# EAGLE design platform_all1 (EAGLE 6.5.0)
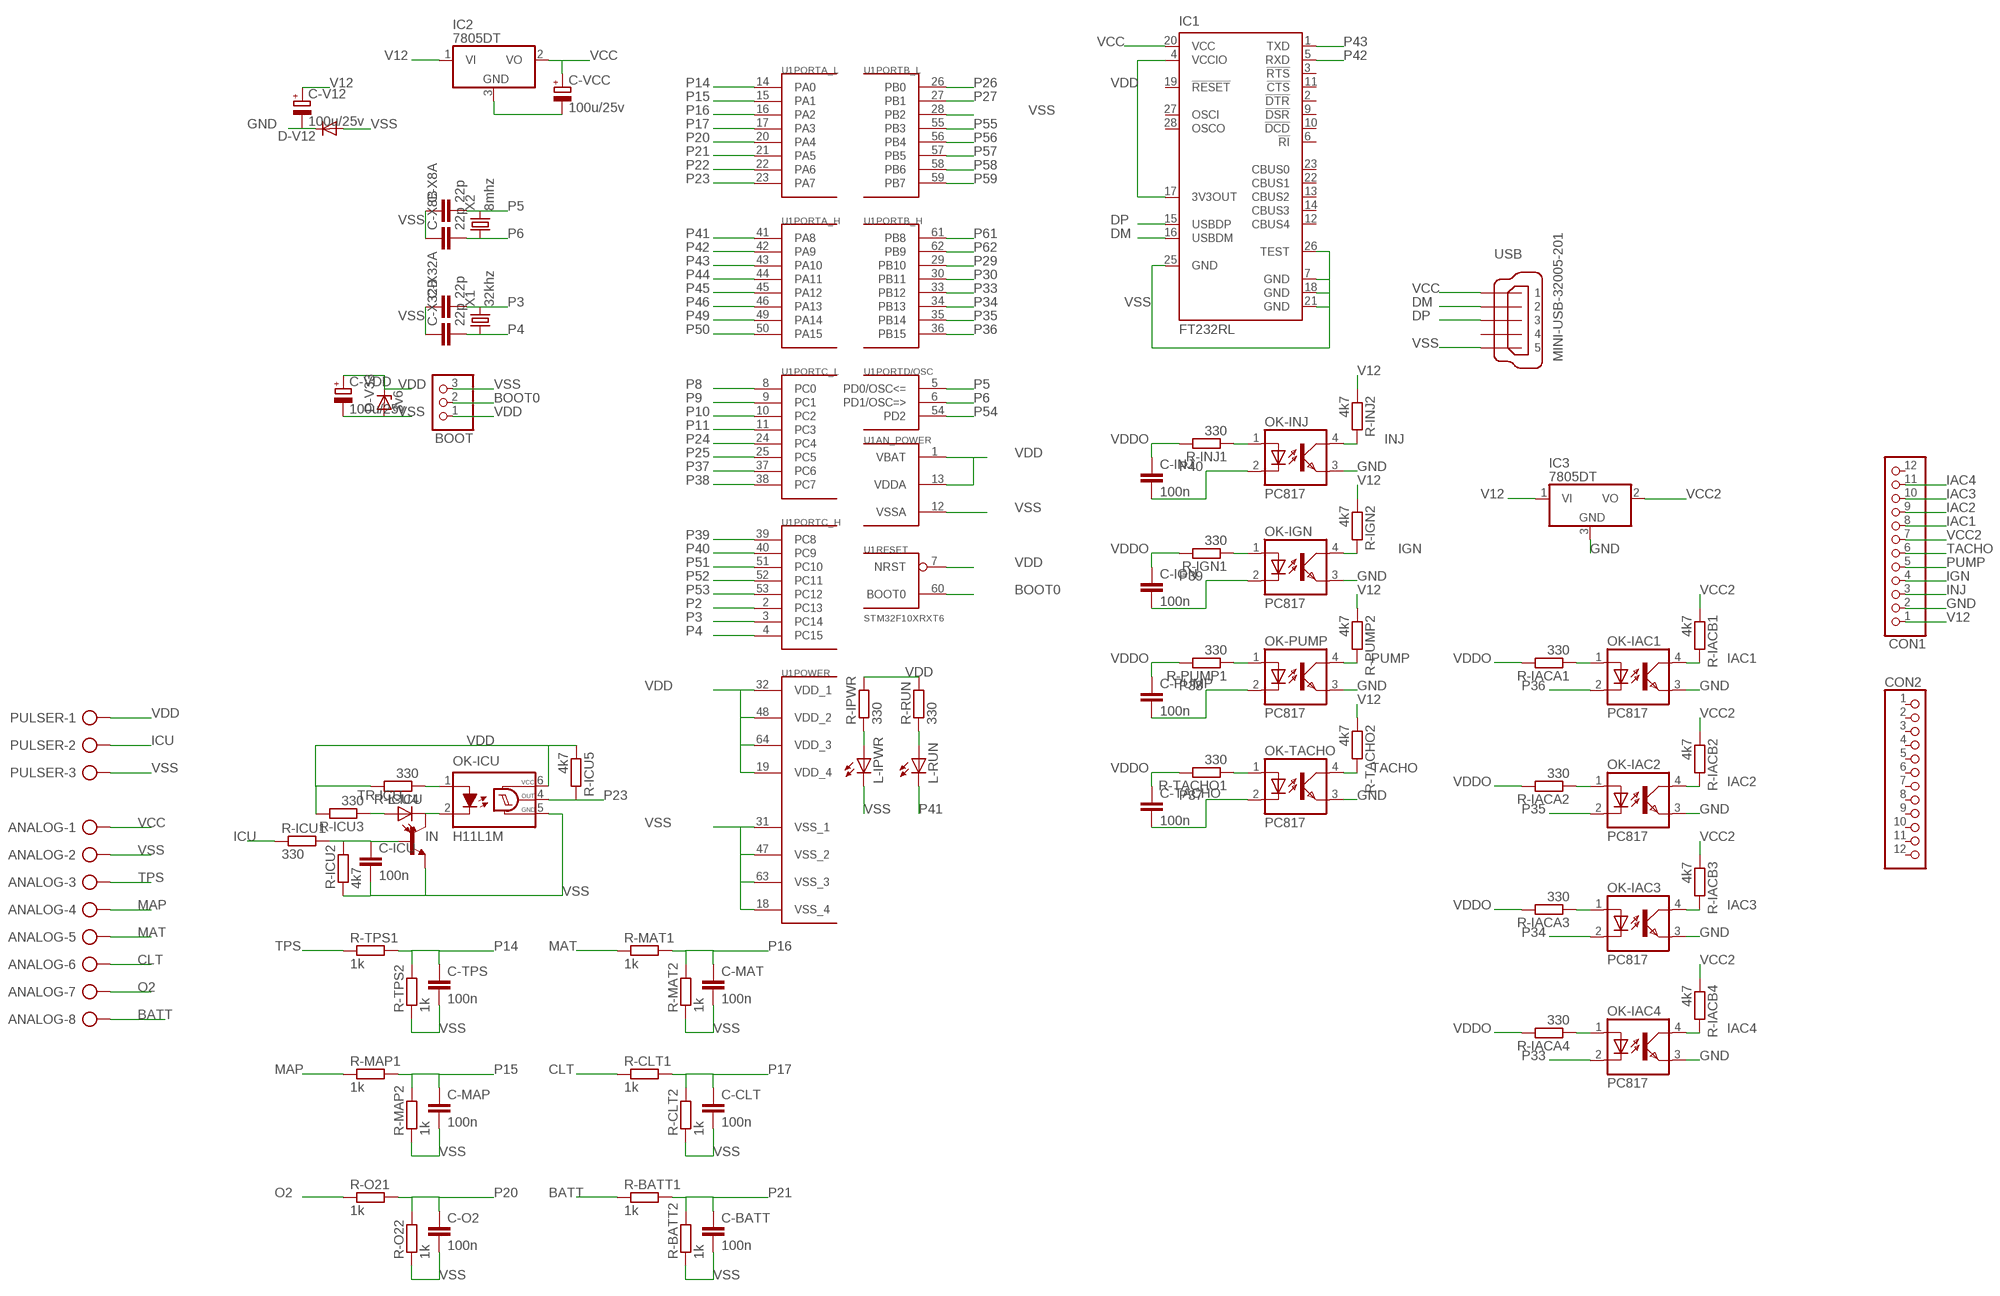
[diagram p0: schematic, sheet 1]

## Parts
ANALOG  AK300/8  [AK300/8]
BOOT  PINHD-1X3  [1X03]
C-BATT  100n  C-EUC1206  [C1206]
C-CLT  100n  C-EUC1206  [C1206]
C-ICU  100n  C-EUC1206  [C1206]
C-IGN  100n  C-EUC1206  [C1206]
C-INJ  100n  C-EUC1206  [C1206]
C-MAP  100n  C-EUC1206  [C1206]
C-MAT  100n  C-EUC1206  [C1206]
C-O2  100n  C-EUC1206  [C1206]
C-PUMP  100n  C-EUC1206  [C1206]
C-TACHO  100n  C-EUC1206  [C1206]
C-TPS  100n  C-EUC1206  [C1206]
C-V12  100u/25v  CPOL-EUD  [PANASONIC_D]
C-VCC  100u/25v  CPOL-EUD  [PANASONIC_D]
C-VDD  100u/25v  CPOL-EUD  [PANASONIC_D]
C-X8A  22p  C-EUC1206  [C1206]
C-X8B  22p  C-EUC1206  [C1206]
C-X32A  22p  C-EUC1206  [C1206]
C-X32B  22p  C-EUC1206  [C1206]
CON1  PINHD-1X12  [1X12]
CON2  PINHD-1X12  [1X12]
D-V12  DIODE-SMB  [SMB]
D-V33  3v6  ZENER-DIODESMB  [SMB]
IC1  FT232RL  [SSOP28]
IC2  7805DT  [TO252]
IC3  7805DT  [TO252]
L-ICU  LEDSMT1206  [1206]
L-IPWR  LEDSMT1206  [1206]
L-RUN  LEDSMT1206  [1206]
OK-IAC1  PC817  [DIL04]
OK-IAC2  PC817  [DIL04]
OK-IAC3  PC817  [DIL04]
OK-IAC4  PC817  [DIL04]
OK-ICU  H11L1M  [DIL06]
OK-IGN  PC817  [DIL04]
OK-INJ  PC817  [DIL04]
OK-PUMP  PC817  [DIL04]
OK-TACHO  PC817  [DIL04]
PULSER  AK300/3  [AK300/3]
R-BATT1  1k  R-EU_R1206  [R1206]
R-BATT2  1k  R-EU_R1206  [R1206]
R-CLT1  1k  R-EU_R1206  [R1206]
R-CLT2  1k  R-EU_R1206  [R1206]
R-IACA1  330  R-EU_R1206  [R1206]
R-IACA2  330  R-EU_R1206  [R1206]
R-IACA3  330  R-EU_R1206  [R1206]
R-IACA4  330  R-EU_R1206  [R1206]
R-IACB1  4k7  R-EU_R1206  [R1206]
R-IACB2  4k7  R-EU_R1206  [R1206]
R-IACB3  4k7  R-EU_R1206  [R1206]
R-IACB4  4k7  R-EU_R1206  [R1206]
R-ICU1  330  R-EU_R1206  [R1206]
R-ICU2  4k7  R-EU_R1206  [R1206]
R-ICU3  330  R-EU_R1206  [R1206]
R-ICU4  330  R-EU_R1206  [R1206]
R-ICU5  4k7  R-EU_R1206  [R1206]
R-IGN1  330  R-EU_R1206  [R1206]
R-IGN2  4k7  R-EU_R1206  [R1206]
R-INJ1  330  R-EU_R1206  [R1206]
R-INJ2  4k7  R-EU_R1206  [R1206]
R-IPWR  330  R-EU_R1206  [R1206]
R-MAP1  1k  R-EU_R1206  [R1206]
R-MAP2  1k  R-EU_R1206  [R1206]
R-MAT1  1k  R-EU_R1206  [R1206]
R-MAT2  1k  R-EU_R1206  [R1206]
R-O21  1k  R-EU_R1206  [R1206]
R-O22  1k  R-EU_R1206  [R1206]
R-PUMP1  330  R-EU_R1206  [R1206]
R-PUMP2  4k7  R-EU_R1206  [R1206]
R-RUN  330  R-EU_R1206  [R1206]
R-TACHO1  330  R-EU_R1206  [R1206]
R-TACHO2  4k7  R-EU_R1206  [R1206]
R-TPS1  1k  R-EU_R1206  [R1206]
R-TPS2  1k  R-EU_R1206  [R1206]
TR-ICU  MMBT3904LT1-NPN-SOT23-BEC  [SOT23-BEC]
U1  STM32F10XRXT6  [TQFP64]
USB  MINI-USB-32005-201  [32005-201]
X1  32khz  CRYSTALTC26V  [TC26V]
X2  8mhz  CRYSTALHC49U-V  [HC49U-V]

## Nets
BATT: ANALOG.8 R-BATT1.1
BOOT0: BOOT.2 U1.60(RESET:BOOT0)
CLT: ANALOG.6 R-CLT1.1
DM: IC1.16(USBDM) USB.2
DP: IC1.15(USBDP) USB.3
GND: C-V12.- CON1.2 D-V12.C IC3.3(GND) OK-IAC1.3(EMIT) OK-IAC2.3(EMIT) OK-IAC3.3(EMIT) OK-IAC4.3(EMIT) OK-IGN.3(EMIT) OK-INJ.3(EMIT) OK-PUMP.3(EMIT) OK-TACHO.3(EMIT)
IAC1: CON1.8 OK-IAC1.4(COL) R-IACB1.2
IAC2: CON1.9 OK-IAC2.4(COL) R-IACB2.2
IAC3: CON1.10 OK-IAC3.4(COL) R-IACB3.2
IAC4: CON1.11 OK-IAC4.4(COL) R-IACB4.2
ICU: PULSER.2 R-ICU1.1
IGN: CON1.4 OK-IGN.4(COL) R-IGN2.2
IN: L-ICU.C OK-ICU.2(C) TR-ICU.C
INJ: CON1.3 OK-INJ.4(COL) R-INJ2.2
MAP: ANALOG.4 R-MAP1.1
MAT: ANALOG.5 R-MAT1.1
N$1: OK-TACHO.1(A) R-TACHO1.1
N$2: OK-IAC2.1(A) R-IACA2.1
N$3: C-ICU.1 R-ICU1.2 R-ICU2.2 TR-ICU.B
N$4: OK-IAC1.1(A) R-IACA1.1
N$5: OK-ICU.1(A) R-ICU4.1
N$6: L-ICU.A R-ICU3.1
N$7: L-IPWR.A R-IPWR.1
N$8: L-RUN.A R-RUN.1
N$9: OK-PUMP.1(A) R-PUMP1.1
N$10: OK-IAC3.1(A) R-IACA3.1
N$11: OK-IAC4.1(A) R-IACA4.1
N$13: OK-INJ.1(A) R-INJ1.1
N$15: OK-IGN.1(A) R-IGN1.1
O2: ANALOG.7 R-O21.1
P2: U1.2(PORTC_H:PC13)
P3: C-X32A.2 U1.3(PORTC_H:PC14) X1.2
P4: C-X32B.2 U1.4(PORTC_H:PC15) X1.1
P5: C-X8A.2 U1.5(PORTD/OSC:PD0/OSC<=) X2.2
P6: C-X8B.2 U1.6(PORTD/OSC:PD1/OSC=>) X2.1
P8: U1.8(PORTC_L:PC0)
P9: U1.9(PORTC_L:PC1)
P10: U1.10(PORTC_L:PC2)
P11: U1.11(PORTC_L:PC3)
P14: C-TPS.1 R-TPS1.2 R-TPS2.2 U1.14(PORTA_L:PA0)
P15: C-MAP.1 R-MAP1.2 R-MAP2.2 U1.15(PORTA_L:PA1)
P16: C-MAT.1 R-MAT1.2 R-MAT2.2 U1.16(PORTA_L:PA2)
P17: C-CLT.1 R-CLT1.2 R-CLT2.2 U1.17(PORTA_L:PA3)
P20: C-O2.1 R-O21.2 R-O22.2 U1.20(PORTA_L:PA4)
P21: C-BATT.1 R-BATT1.2 R-BATT2.2 U1.21(PORTA_L:PA5)
P22: U1.22(PORTA_L:PA6)
P23: OK-ICU.4(OUT) R-ICU5.2 U1.23(PORTA_L:PA7)
P24: U1.24(PORTC_L:PC4)
P25: U1.25(PORTC_L:PC5)
P26: U1.26(PORTB_L:PB0)
P27: U1.27(PORTB_L:PB1)
P29: U1.29(PORTB_H:PB10)
P30: U1.30(PORTB_H:PB11)
P33: OK-IAC4.2(C) U1.33(PORTB_H:PB12)
P34: OK-IAC3.2(C) U1.34(PORTB_H:PB13)
P35: OK-IAC2.2(C) U1.35(PORTB_H:PB14)
P36: OK-IAC1.2(C) U1.36(PORTB_H:PB15)
P37: C-TACHO.2 OK-TACHO.2(C) U1.37(PORTC_L:PC6)
P38: C-PUMP.2 OK-PUMP.2(C) U1.38(PORTC_L:PC7)
P39: C-IGN.2 OK-IGN.2(C) U1.39(PORTC_H:PC8)
P40: C-INJ.2 OK-INJ.2(C) U1.40(PORTC_H:PC9)
P41: L-RUN.C U1.41(PORTA_H:PA8)
P42: IC1.5(RXD) U1.42(PORTA_H:PA9)
P43: IC1.1(TXD) U1.43(PORTA_H:PA10)
P44: U1.44(PORTA_H:PA11)
P45: U1.45(PORTA_H:PA12)
P46: U1.46(PORTA_H:PA13)
P49: U1.49(PORTA_H:PA14)
P50: U1.50(PORTA_H:PA15)
P51: U1.51(PORTC_H:PC10)
P52: U1.52(PORTC_H:PC11)
P53: U1.53(PORTC_H:PC12)
P54: U1.54(PORTD/OSC:PD2)
P55: U1.55(PORTB_L:PB3)
P56: U1.56(PORTB_L:PB4)
P57: U1.57(PORTB_L:PB5)
P58: U1.58(PORTB_L:PB6)
P59: U1.59(PORTB_L:PB7)
P61: U1.61(PORTB_H:PB8)
P62: U1.62(PORTB_H:PB9)
PUMP: CON1.5 OK-PUMP.4(COL) R-PUMP2.2
TACHO: CON1.6 OK-TACHO.4(COL) R-TACHO2.2
TPS: ANALOG.3 R-TPS1.1
V12: C-V12.+ CON1.1 IC2.1(VI) IC3.1(VI) R-IGN2.1 R-INJ2.1 R-PUMP2.1 R-TACHO2.1
VCC: ANALOG.1 C-VCC.+ IC1.20(VCC) IC2.2(VO) USB.1
VCC2: CON1.7 IC3.2(VO) R-IACB1.1 R-IACB2.1 R-IACB3.1 R-IACB4.1
VDD: BOOT.1 C-VDD.+ D-V33.C IC1.4(VCCIO) IC1.17(3V3OUT) OK-ICU.6(VCC) PULSER.1 R-ICU3.2 R-ICU4.2 R-ICU5.1 R-IPWR.2 R-RUN.2 U1.1(AN_POWER:VBAT) U1.7(RESET:NRST) U1.13(AN_POWER:VDDA) U1.19(POWER:VDD_4) U1.32(POWER:VDD_1) U1.48(POWER:VDD_2) U1.64(POWER:VDD_3)
VDDO: C-IGN.1 C-INJ.1 C-PUMP.1 C-TACHO.1 R-IACA1.2 R-IACA2.2 R-IACA3.2 R-IACA4.2 R-IGN1.2 R-INJ1.2 R-PUMP1.2 R-TACHO1.2
VSS: ANALOG.2 BOOT.3 C-BATT.2 C-CLT.2 C-ICU.2 C-MAP.2 C-MAT.2 C-O2.2 C-TPS.2 C-VCC.- C-VDD.- C-X8A.1 C-X8B.1 C-X32A.1 C-X32B.1 D-V12.A D-V33.A IC1.7(GND) IC1.18(GND) IC1.21(GND) IC1.25(GND) IC1.26(TEST) IC2.3(GND) L-IPWR.C OK-ICU.5(GND) PULSER.3 R-BATT2.1 R-CLT2.1 R-ICU2.1 R-MAP2.1 R-MAT2.1 R-O22.1 R-TPS2.1 TR-ICU.E U1.12(AN_POWER:VSSA) U1.18(POWER:VSS_4) U1.28(PORTB_L:PB2) U1.31(POWER:VSS_1) U1.47(POWER:VSS_2) U1.63(POWER:VSS_3) USB.5
Unconnected: CON1.12 CON2.1 CON2.2 CON2.3 CON2.4 CON2.5 CON2.6 CON2.7 CON2.8 CON2.9 CON2.10 CON2.11 CON2.12 IC1.2(!DTR) IC1.3(!RTS) IC1.6(!RI) IC1.9(!DSR) IC1.10(!DCD) IC1.11(!CTS) IC1.12(CBUS4) IC1.13(CBUS2) IC1.14(CBUS3) IC1.19(!RESET) IC1.22(CBUS1) IC1.23(CBUS0) IC1.27(OSCI) IC1.28(OSCO) USB.4

## Library data of the parts
ANALOG = con-ptr500:AK300/8: CONNECTOR; OC_FARNELL: unknown; OC_NEWARK: unknown
BOOT = pinhead:PINHD-1X3: PIN HEADER
C-BATT C-CLT C-ICU C-IGN C-INJ C-MAP C-MAT C-O2 C-PUMP C-TACHO C-TPS C-X8A C-X8B C-X32A C-X32B = resistor:C-EU: CAPACITOR, European symbol
C-V12 C-VCC C-VDD = resistor:CPOL-EU: POLARIZED CAPACITOR, European symbol
CON1 CON2 = pinhead:PINHD-1X12: PIN HEADER
D-V12 = diode:DIODE-: DIODE
D-V33 = diode:ZENER-DIODE: Z-Diode
IC1 = ftdichip:FT232R: Source: http://www.ftdichip.com/Documents/DataSheets/DS_FT232R_v104.pdf; MPN: FT232RL; OC_FARNELL: 1146032; OC_NEWARK: 91K9918
IC2 IC3 = linear:78*: Positive VOLTAGE REGULATOR Source: http://cache.national.com/ds/LM/LM78L05.pdf http://www.fairchildsemi.com/ds/LM/LM7805.pdf
L-ICU L-IPWR L-RUN = led:LED: LED OSRAM: - CHIPLED LG R971, LG N971, LY N971, LG Q971, LY Q971, LO R971, LY R971 LH N974, LH R974 LS Q976, LO Q976, LY Q976 LO Q996 - Hyper CHIPLED LW Q18S LB Q993, LB Q99A, LB R99A - SideLED LS A670, LO A670, LY A670, LG A670, LP A670 LB A673, LV A673, LT A673, LW A673 LH A674 LY A675 LS A676, LA A676, LO A676, LY A676, LW A676 LS A679, LY A679, LG A679 - Hyper Micro SIDELED® LS Y876, LA Y876, LO Y876, LY Y876 LT Y87S - SmartLED LW L88C, LW L88S LB L89C, LB L89S, LG L890 LS L89K, LO L89K, LY L89K LS L896, LA L896, LO L896, LY L896 - TOPLED LS T670, LO T670, LY T670, LG T670, LP T670 LSG T670, LSP T670, LSY T670, LOP T670, LYG T670 LG T671, LOG T671, LSG T671 LB T673, LV T673, LT T673, LW T673 LH T674 LS T676, LA T676, LO T676, LY T676, LB T676, LH T676, LSB T676, LW T676 LB T67C, LV T67C, LT T67C, LS T67K, LO T67K, LY T67K, LW E67C LS E67B, LA E67B, LO E67B, LY E67B, LB E67C, LV E67C, LT E67C LW T67C LS T679, LY T679, LG T679 LS T770, LO T770, LY T770, LG T770, LP T770 LB T773, LV T773, LT T773, LW T773 LH T774 LS E675, LA E675, LY E675, LS T675 LS T776, LA T776, LO T776, LY T776, LB T776 LHGB T686 LT T68C, LB T68C - Hyper Mini TOPLED® LB M676 - Mini TOPLED Santana® LG M470 LS M47K, LO M47K, LY M47K Source: http://www.osram.convergy.de LUXEON: - LUMILED® LXK2-PW12-R00, LXK2-PW12-S00, LXK2-PW14-U00, LXK2-PW14-V00 LXK2-PM12-R00, LXK2-PM12-S00, LXK2-PM14-U00 LXK2-PE12-Q00, LXK2-PE12-R00, LXK2-PE12-S00, LXK2-PE14-T00, LXK2-PE14-U00 LXK2-PB12-K00, LXK2-PB12-L00, LXK2-PB12-M00, LXK2-PB14-N00, LXK2-PB14-P00, LXK2-PB14-Q00 LXK2-PR12-L00, LXK2-PR12-M00, LXK2-PR14-Q00, LXK2-PR14-R00 LXK2-PD12-Q00, LXK2-PD12-R00, LXK2-PD12-S00 LXK2-PH12-R00, LXK2-PH12-S00 LXK2-PL12-P00, LXK2-PL12-Q00, LXK2-PL12-R00 Source: www.luxeon.com KINGBRIGHT: KA-3528ASYC Source: www.kingbright.com
OK-IAC1-OK-IAC4 OK-IGN OK-INJ OK-PUMP OK-TACHO = optocoupler:PC817: SHARP OPTO COUPLER; MPN: PC817X4J000F; OC_FARNELL: 9707727; OC_NEWARK: 97K7059
OK-ICU = optocoupler:H11L*M: 6-Pin DIP Optocoupler Source: http://www.fairchildsemi.com/ds/H1/H11L2-M.pdf; MF: FAIRCHILD SEMICONDUCTOR; MPN: H11L1-M; OC_FARNELL: 1021127; OC_NEWARK: 72K8643
PULSER = con-ptr500:AK300/3: CONNECTOR; OC_FARNELL: unknown; OC_NEWARK: unknown
R-BATT1 R-BATT2 R-CLT1 R-CLT2 R-IACA1-R-IACA4 R-IACB1-R-IACB4 R-ICU1-R-ICU5 R-IGN1 R-IGN2 R-INJ1 R-INJ2 R-IPWR R-MAP1 R-MAP2 R-MAT1 R-MAT2 R-O21 R-O22 R-PUMP1 R-PUMP2 R-RUN R-TACHO1 R-TACHO2 R-TPS1 R-TPS2 = resistor:R-EU_: RESISTOR, European symbol
TR-ICU = transistor:*-NPN-: NPN Transistror BF959 corrected 2008.03.06
U1 = stm32:STM32F10XRXT6: STM32F101/103 64pin LQFP
USB = con-cypressindustries:MINI-USB-: MINI USB-B Conector Source: www.cypressindustries.com; OC_FARNELL: unknown; OC_NEWARK: unknown
X1 = crystal:CRYSTAL: CRYSTAL; OC_FARNELL: unknown; OC_NEWARK: unknown
X2 = crystal:CRYSTAL: CRYSTAL; OC_FARNELL: 1666969; OC_NEWARK: unknown

## Board
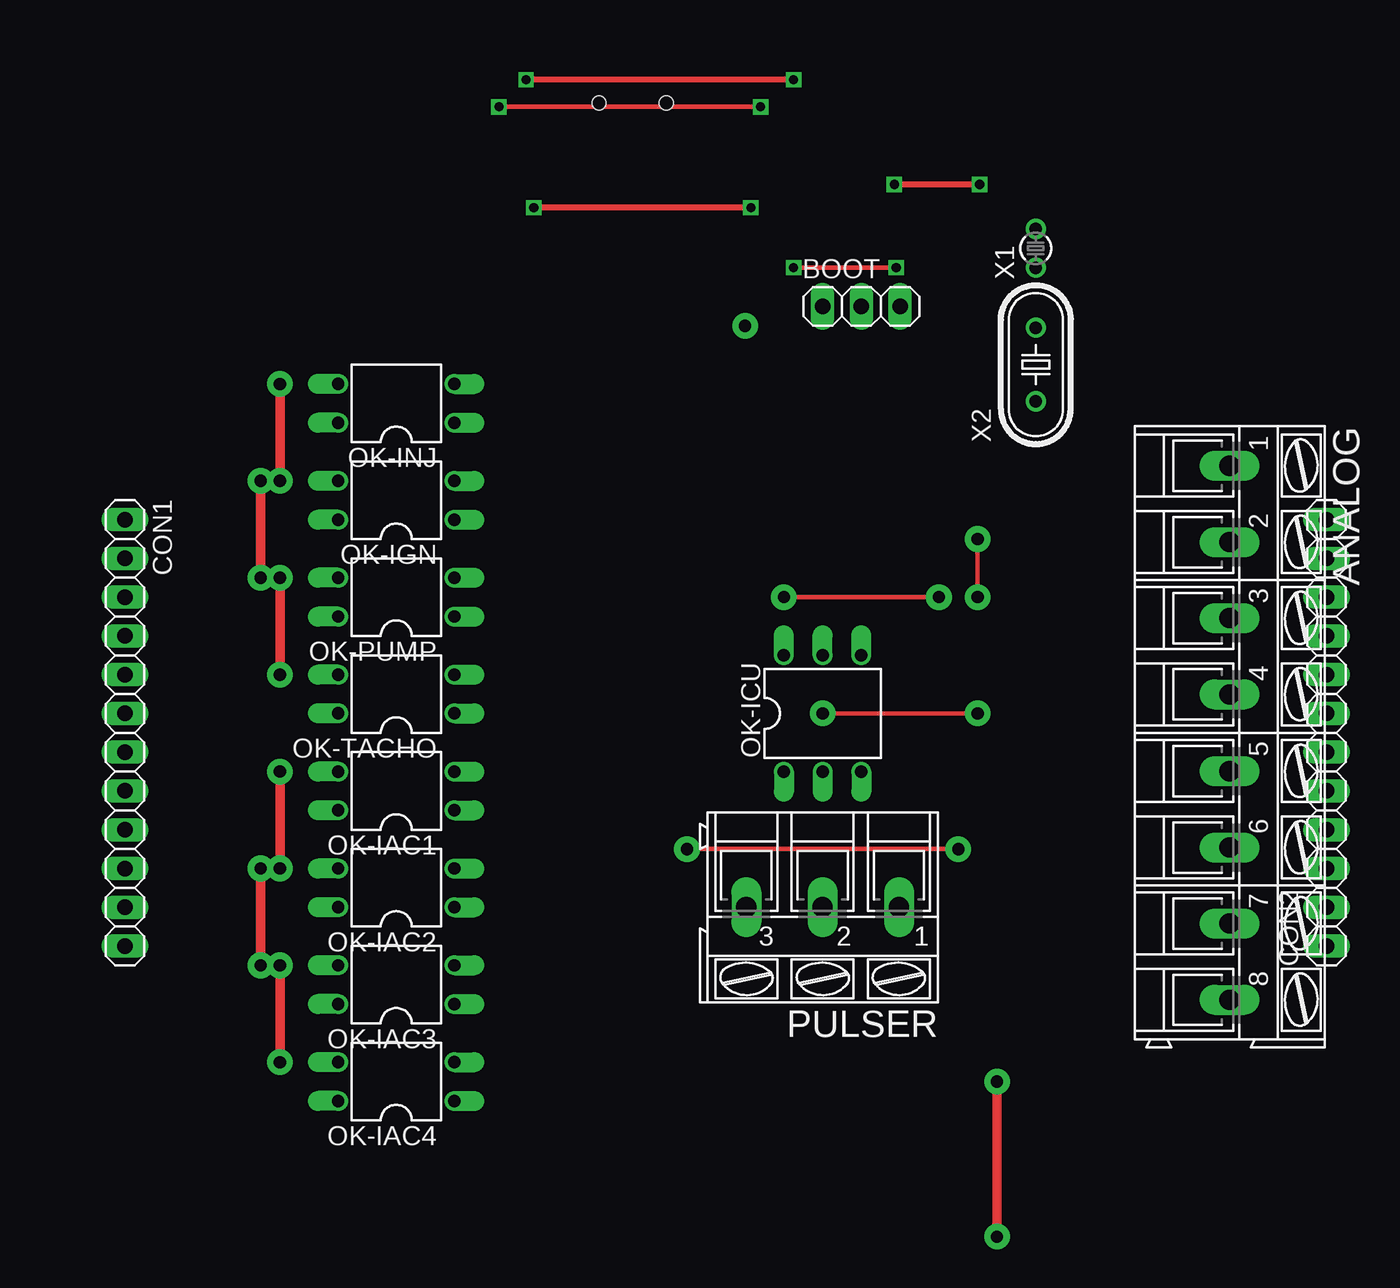
[diagram p1: board, top side]
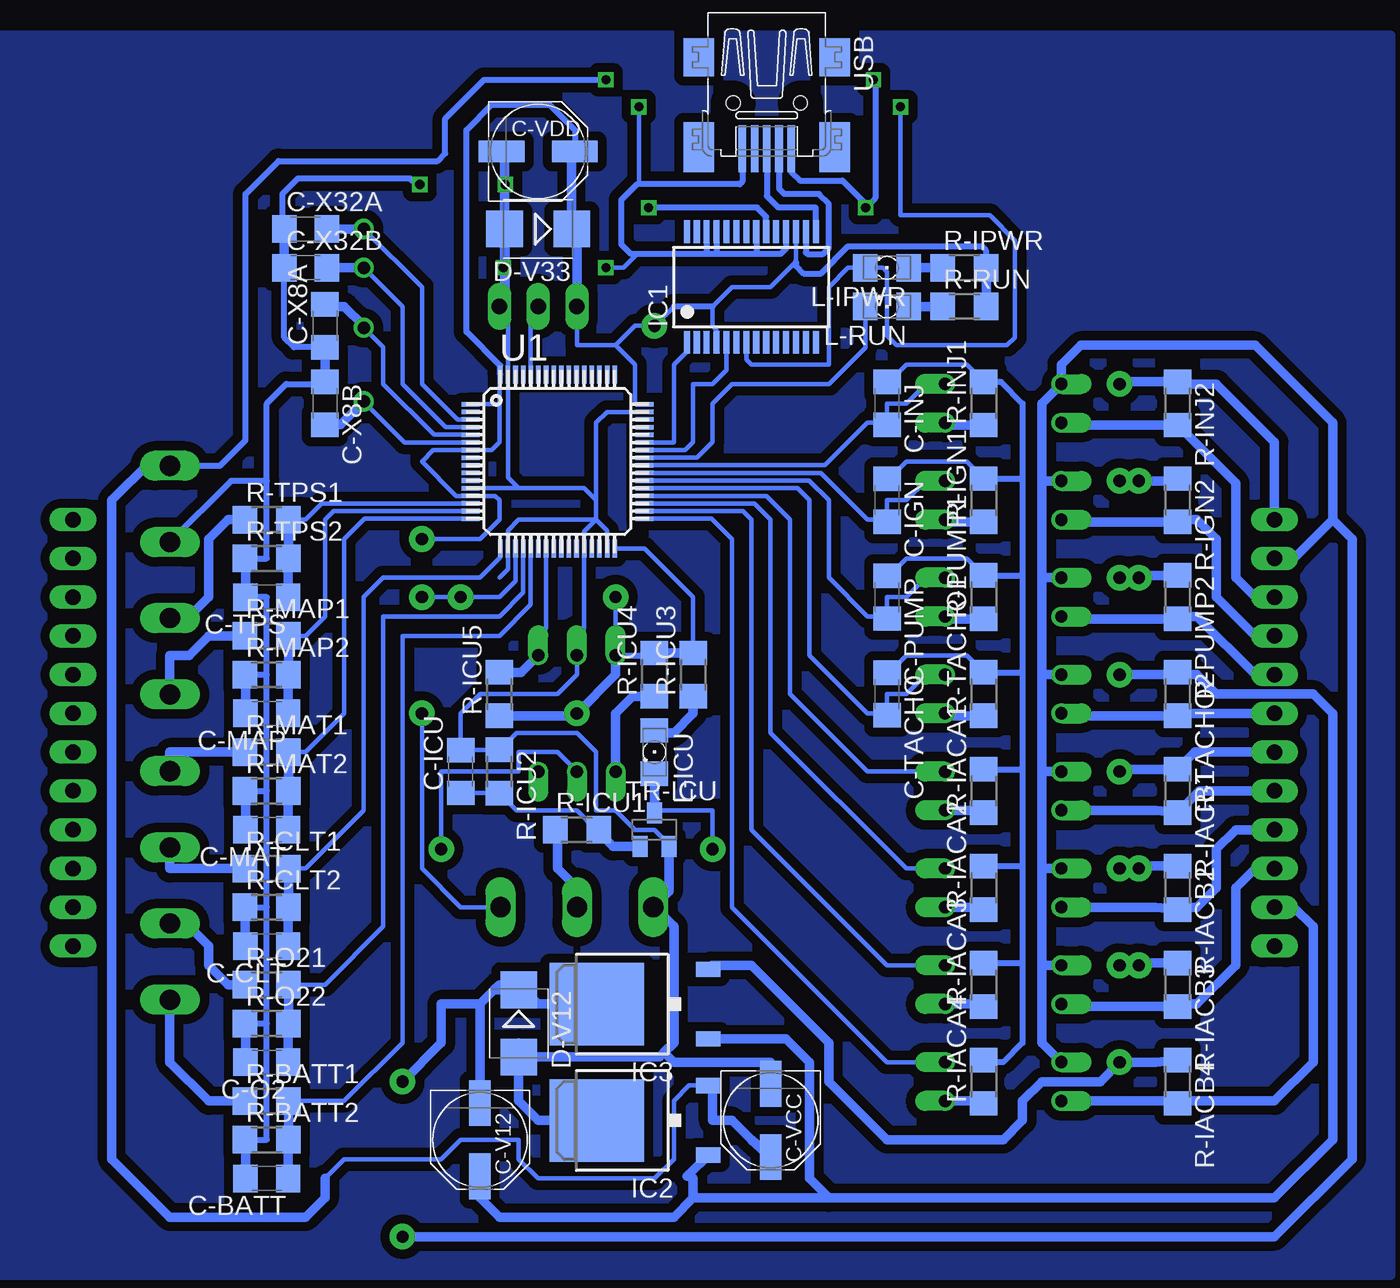
[diagram p2: board, bottom side, seen from below]

No outline drawn. Coordinates in mm, seen from the top.
Copper layers (1*16): Top 0.035mm / dielectric 1.5mm / Bottom 0.035mm
Design rules "default": minimum track width 10mil, minimum drill 24mil, track to track 8mil, track to pad 8mil, pad to pad 8mil, via to via 8mil, smd to smd 8mil, copper to edge 40mil, drill to drill 8mil, minimum pad ring 10mil, minimum via ring 8mil, stop-mask expansion 4mil, vias tented up to drill 0mil, thermal gap 10mil

### Footprints (pad centres in the part's own frame; a part is rotated, then mirrored left to right if it is on the bottom)
AK300/8 = drill 1.321 long: 1 -17.501,0; 2 -12.497,0; 3 -7.518,0; 4 -2.515,0; 5 2.515,0; 6 7.518,0; 7 12.497,0; 8 17.501,0
1X03 = drill 1.016 long: 1 -2.54,0; 2 0,0; 3 2.54,0
C1206 = smd 1.6 x 1.8: 1 -1.4,0; 2 1.4,0
PANASONIC_D = smd 3 x 1.4: + 2.4,0; - -2.4,0
1X12 = drill 1.016 long: 1 -13.97,0; 2 -11.43,0; 3 -8.89,0; 4 -6.35,0; 5 -3.81,0; 6 -1.27,0; 7 1.27,0; 8 3.81,0; 9 6.35,0; 10 8.89,0; 11 11.43,0; 12 13.97,0
SMB = smd 2.4 x 2.4: A 2.2,0; C -2.2,0
SSOP28 = smd 0.4 x 1.5: 1 -4.225,-3.625; 2 -3.575,-3.625; 3 -2.925,-3.625; 4 -2.275,-3.625; 5 -1.625,-3.625; 6 -0.975,-3.625; 7 -0.325,-3.625; 8 0.325,-3.625; 9 0.975,-3.625; 10 1.625,-3.625; 11 2.275,-3.625; 12 2.925,-3.625; 13 3.575,-3.625; 14 4.225,-3.625; 15 4.225,3.625; 16 3.575,3.625; 17 2.925,3.625; 18 2.275,3.625; 19 1.625,3.625; 20 0.975,3.625; 21 0.325,3.625; 22 -0.325,3.625; 23 -0.975,3.625; 24 -1.625,3.625; 25 -2.275,3.625; 26 -2.925,3.625; 27 -3.575,3.625; 28 -4.225,3.625
TO252 = smd 1 x 1.6: 1 -2.28,-4.8; 2 2.28,-4.8 | smd 5.4 x 6.2: 3 0,2.5
1206 = smd 1.6 x 1.803: A -1.422,0; C 1.422,0
DIL04 = drill 0.813 offset: 1 -1.27,-3.81; 2 1.27,-3.81; 3 1.27,3.81; 4 -1.27,3.81
DIL06 = drill 0.813 offset: 1 -2.54,-3.81; 2 0,-3.81; 3 2.54,-3.81; 4 2.54,3.81; 5 0,3.81; 6 -2.54,3.81
AK300/3 = drill 1.321 long: 1 -5.004,0; 2 0,0; 3 5.004,0
R1206 = smd 1.6 x 1.803: 1 -1.422,0; 2 1.422,0
SOT23-BEC = smd 1 x 1.4: B -0.95,-1.1; C 0,1.1; E 0.95,-1.1
TQFP64 = smd 1.2 x 0.3: 1 -5.7,3.75; 2 -5.7,3.25; 3 -5.7,2.75; 4 -5.7,2.25; 5 -5.7,1.75; 6 -5.7,1.25; 7 -5.7,0.75; 8 -5.7,0.25; 9 -5.7,-0.25; 10 -5.7,-0.75; 11 -5.7,-1.25; 12 -5.7,-1.75; 13 -5.7,-2.25; 14 -5.7,-2.75; 15 -5.7,-3.25; 16 -5.7,-3.75; 33 5.7,-3.75; 34 5.7,-3.25; 35 5.7,-2.75; 36 5.7,-2.25; 37 5.7,-1.75; 38 5.7,-1.25; 39 5.7,-0.75; 40 5.7,-0.25; 41 5.7,0.25; 42 5.7,0.75; 43 5.7,1.25; 44 5.7,1.75; 45 5.7,2.25; 46 5.7,2.75; 47 5.7,3.25; 48 5.7,3.75 | smd 0.3 x 1.2: 17 -3.75,-5.7; 18 -3.25,-5.7; 19 -2.75,-5.7; 20 -2.25,-5.7; 21 -1.75,-5.7; 22 -1.25,-5.7; 23 -0.75,-5.7; 24 -0.25,-5.7; 25 0.25,-5.7; 26 0.75,-5.7; 27 1.25,-5.7; 28 1.75,-5.7; 29 2.25,-5.7; 30 2.75,-5.7; 31 3.25,-5.7; 32 3.75,-5.7; 49 3.75,5.7; 50 3.25,5.7; 51 2.75,5.7; 52 2.25,5.7; 53 1.75,5.7; 54 1.25,5.7; 55 0.75,5.7; 56 0.25,5.7; 57 -0.25,5.7; 58 -0.75,5.7; 59 -1.25,5.7; 60 -1.75,5.7; 61 -2.25,5.7; 62 -2.75,5.7; 63 -3.25,5.7; 64 -3.75,5.7
32005-201 = smd 3.1 x 0.5: 1 3,1.6; 2 3,0.8; 3 3,0; 4 3,-0.8; 5 3,-1.6 | smd 2.5 x 2: M1 -3,-4.45; M2 -3,4.45 | smd 3.3 x 2: M3 2.9,4.45; M4 2.9,-4.45 | hole 0.9: 0,2.2; 0,-2.2
TC26V = drill 0.813: 1 -1.27,0; 2 1.27,0
HC49U-V = drill 0.813: 1 -2.413,0; 2 2.413,0

### Placement (x,y rotation side)
ANALOG  81.28,34.29 270 top
BOOT  57.15,62.23 0 top
C-BATT  74.93,5.08 180 bottom
C-CLT  74.93,20.32 180 bottom
C-ICU  62.23,31.75 90 bottom
C-IGN  34.29,49.53 270 bottom
C-INJ  34.29,55.88 270 bottom
C-MAP  74.93,35.56 180 bottom
C-MAT  74.93,27.94 180 bottom
C-O2  74.93,12.7 180 bottom
C-PUMP  34.29,43.18 270 bottom
C-TACHO  34.29,36.83 270 bottom
C-TPS  74.93,43.18 180 bottom
C-V12  60.96,7.62 270 bottom
C-VCC  41.91,8.89 270 bottom
C-VDD  57.15,72.39 0 bottom
C-X8A  71.12,60.96 90 bottom
C-X8B  71.12,55.88 270 bottom
C-X32A  72.39,67.31 0 bottom
C-X32B  72.39,64.77 0 bottom
CON1  8.89,34.29 270 top
CON2  87.63,34.29 90 top
D-V12  58.42,15.24 270 bottom
D-V33  57.15,67.31 180 bottom
IC1  43.18,63.5 0 bottom
IC2  50.8,8.89 90 bottom
IC3  50.8,16.51 90 bottom
L-ICU  49.53,33.02 270 bottom
L-IPWR  34.29,64.77 180 bottom
L-RUN  34.29,62.23 180 bottom
OK-IAC1  26.67,30.48 90 top
OK-IAC2  26.67,24.13 90 top
OK-IAC3  26.67,17.78 90 top
OK-IAC4  26.67,11.43 90 top
OK-ICU  54.61,35.56 0 top
OK-IGN  26.67,49.53 90 top
OK-INJ  26.67,55.88 90 top
OK-PUMP  26.67,43.18 90 top
OK-TACHO  26.67,36.83 90 top
PULSER  54.61,22.86 180 top
R-BATT1  74.93,10.16 0 bottom
R-BATT2  74.93,7.62 0 bottom
R-CLT1  74.93,25.4 0 bottom
R-CLT2  74.93,22.86 0 bottom
R-IACA1  27.94,30.48 90 bottom
R-IACA2  27.94,24.13 90 bottom
R-IACA3  27.94,17.78 90 bottom
R-IACA4  27.94,11.43 90 bottom
R-IACB1  15.24,30.48 270 bottom
R-IACB2  15.24,24.13 270 bottom
R-IACB3  15.24,17.78 270 bottom
R-IACB4  15.24,11.43 270 bottom
R-ICU1  54.61,27.94 0 bottom
R-ICU2  59.69,31.75 270 bottom
R-ICU3  46.99,38.1 90 bottom
R-ICU4  49.53,38.1 90 bottom
R-ICU5  59.69,36.83 90 bottom
R-IGN1  27.94,49.53 90 bottom
R-IGN2  15.24,49.53 270 bottom
R-INJ1  27.94,55.88 90 bottom
R-INJ2  15.24,55.88 270 bottom
R-IPWR  29.21,64.77 0 bottom
R-MAP1  74.93,40.64 0 bottom
R-MAP2  74.93,38.1 0 bottom
R-MAT1  74.93,33.02 0 bottom
R-MAT2  74.93,30.48 0 bottom
R-O21  74.93,17.78 0 bottom
R-O22  74.93,15.24 0 bottom
R-PUMP1  27.94,43.18 90 bottom
R-PUMP2  15.24,43.18 270 bottom
R-RUN  29.21,62.23 0 bottom
R-TACHO1  27.94,36.83 90 bottom
R-TACHO2  15.24,36.83 270 bottom
R-TPS1  74.93,48.26 0 bottom
R-TPS2  74.93,45.72 0 bottom
TR-ICU  49.53,27.94 0 bottom
U1  55.88,52.07 0 bottom
USB  42.16,75.56 270 bottom
X1  68.58,66.04 90 top
X2  68.58,58.42 90 top

### Tracks (layer width: path | path; a pad name or v marks a point on that pad's centre or on a via)
BATT
  Bottom 0.61: R-BATT1.1 78.74,10.16 81.28,12.7 ANALOG.8
BOOT0
  Bottom 0.305: U1.60 57.63,61.75 BOOT.2
CLT
  Bottom 0.61: R-CLT1.1 81.28,25.4 ANALOG.6
DM
  Bottom 0.406: USB.2 41.36,69.94 41.02,69.6 38.73,69.6 38.1,68.96 38.1,66.04 38.48,65.66 39.5,65.66 39.6,65.77 IC1.16
DP
  Bottom 0.406: USB.3 42.16,69.47 41.4,68.71 38.99,68.71 38.95,68.67 IC1.15
GND  (via drill 0.8 pad 1.68)
  Top 0.61: v66.04,11.43 v66.04,1.27
  Bottom 0.61: 60.03,17.44 D-V12.C 57.49,16.51 IC3.3 57.15,16.51 58.42,17.78 59.69,17.78 60.03,17.44 | 60.03,17.44 60.96,16.51 | 60.96,16.51 C-V12.- | 24.13,50.8 24.13,55.88 OK-INJ.3 22.86,58.42 21.59,59.69 10.16,59.69 5.08,54.61 5.08,48.26 | 24.13,50.8 24.13,44.45 | 24.13,44.45 24.13,38.1 | 24.13,38.1 24.13,31.75 | 24.13,31.75 24.13,25.4 | 24.13,25.4 24.13,19.05 | 24.13,19.05 24.13,13.97 OK-IAC4.3 | OK-IAC3.3 24.13,19.05 | OK-IAC2.3 24.13,25.4 | OK-IAC1.3 24.13,31.75 | OK-TACHO.3 24.13,38.1 | OK-PUMP.3 24.13,44.45 | OK-IGN.3 24.13,50.8 | CON1.2 7.62,45.72 5.08,48.26 | 60.96,16.51 63.5,16.51 63.5,13.97 v66.04,11.43 | v66.04,1.27 8.89,1.27 3.81,6.35 3.81,46.99 5.08,48.26
IAC1
  Bottom 0.61: OK-IAC1.4 16.66,29.21 R-IACB1.2 13.82,30.48 CON1.8
IAC2
  Bottom 0.61: OK-IAC2.4 16.66,22.86 R-IACB2.2 15.09,22.86 13.97,22.86 12.7,24.13 12.7,26.67 11.43,27.94 CON1.9
IAC3
  Bottom 0.61: OK-IAC3.4 22.71,16.36 R-IACB3.2 15.09,16.51 13.97,16.51 11.43,19.05 11.43,24.13 10.16,25.4 CON1.10
IAC4
  Bottom 0.61: OK-IAC4.4 15.39,10.16 R-IACB4.2 15.09,10.16 8.89,10.16 6.35,12.7 6.35,21.59 7.62,22.86 CON1.11
ICU
  Bottom 0.61: PULSER.2 54.61,24.13 55.88,25.4 55.88,27.79 R-ICU1.1
IGN
  Bottom 0.61: OK-IGN.4 22.71,48.11 R-IGN2.2 15.09,48.26 13.97,48.26 12.7,46.99 12.7,43.18 10.16,40.64 CON1.4
IN  (via drill 0.8 pad 1.68)
  Top 0.305: v63.5,26.67 v45.72,26.67
  Bottom 0.305: OK-ICU.2 55.88,33.02 58.42,33.02 58.42,31.75 63.5,31.75 v63.5,26.67 | v45.72,26.67 45.72,29.21 49.36,29.21 TR-ICU.C
  Bottom 0.61: TR-ICU.C L-ICU.C
INJ
  Bottom 0.61: OK-INJ.4 22.71,54.46 R-INJ2.2 11.43,50.65 11.43,44.45 10.16,43.18 CON1.3
MAP
  Bottom 0.61: R-MAP1.1 78.74,40.64 80.01,39.37 81.28,39.37 ANALOG.4
MAT
  Bottom 0.61: R-MAT1.1 81.28,33.02 ANALOG.5
N$1
  Bottom 0.61: R-TACHO1.1 30.33,35.41 OK-TACHO.1
N$2
  Bottom 0.61: OK-IAC2.1 28.09,22.86 R-IACA2.1
N$3
  Bottom 0.305: 53.34,27.94 54.61,29.21 58.57,29.21 R-ICU2.2 59.71,30.35 C-ICU.1
  Bottom 0.61: TR-ICU.B 52.24,26.84 53.34,27.94 R-ICU1.2
N$4
  Bottom 0.61: OK-IAC1.1 28.09,29.21 R-IACA1.1
N$5
  Bottom 0.61: R-ICU4.1 50.95,36.68 52.07,35.56 OK-ICU.1
N$6
  Bottom 0.61: R-ICU3.1 46.99,35.56 48.26,34.29 49.38,34.29 L-ICU.A
N$7
  Bottom 0.61: L-IPWR.A R-IPWR.1
N$8
  Bottom 0.61: L-RUN.A R-RUN.1
N$9
  Bottom 0.61: R-PUMP1.1 30.33,41.76 OK-PUMP.1
N$10
  Bottom 0.61: OK-IAC3.1 28.09,16.51 R-IACA3.1
N$11
  Bottom 0.61: OK-IAC4.1 28.09,10.16 R-IACA4.1
N$13
  Bottom 0.61: R-INJ1.1 30.33,54.46 OK-INJ.1
N$14
  pour Bottom (isolate 0.61): 1.27,80.01 92.71,80.01 92.71,-1.27 1.27,-1.27
N$15
  Bottom 0.61: R-IGN1.1 30.33,48.11 OK-IGN.1
O2
  Bottom 0.61: R-O21.1 77.47,17.78 78.74,19.05 78.74,20.32 80.01,21.59 81.08,21.59 ANALOG.7
P3
  Bottom 0.305: U1.3 62.44,54.82 64.77,57.15 64.77,63.5 X1.2
  Bottom 0.61: X1.2 C-X32A.2
P4
  Bottom 0.305: U1.4 63.21,54.32 66.04,57.15 66.04,62.23 X1.1
  Bottom 0.61: X1.1 C-X32B.2
P5
  Bottom 0.305: U1.5 63.98,53.82 67.31,57.15 67.31,59.56 X2.2
  Bottom 0.61: X2.2 68.58,60.96 69.85,62.23 70.99,62.23 C-X8A.2
P6
  Bottom 0.305: U1.6 65.89,53.32 X2.1
  Bottom 0.61: C-X8B.2 70.11,54.48 X2.1
P14
  Bottom 0.305: U1.14 71.33,49.32 72.39,48.26 R-TPS1.2
  Bottom 0.61: C-TPS.1 73.53,45.7 R-TPS2.2 R-TPS1.2
P15
  Bottom 0.305: U1.15 70.56,48.82 71.12,48.26 71.12,41.91 72.39,40.64 R-MAP1.2
  Bottom 0.61: C-MAP.1 73.53,38.08 R-MAP2.2 R-MAP1.2
P16
  Bottom 0.305: U1.16 68.52,48.32 69.85,46.99 69.85,35.56 72.39,33.02 R-MAT1.2
  Bottom 0.61: C-MAT.1 73.53,30.46 R-MAT2.2 R-MAT1.2
P17
  Bottom 0.305: U1.17 59.63,45.78 60.96,44.45 67.31,44.45 68.58,43.18 68.58,29.21 72.39,25.4 R-CLT1.2
  Bottom 0.61: C-CLT.1 73.53,22.84 R-CLT2.2 R-CLT1.2
P20
  Bottom 0.305: U1.20 58.13,43.47 59.69,41.91 67.31,41.91 67.31,21.59 71.12,17.78 R-O21.2
  Bottom 0.61: C-O2.1 73.53,15.22 R-O22.2 R-O21.2
P21
  Bottom 0.305: U1.21 57.63,42.7 59.69,40.64 66.04,40.64 66.04,13.97 69.85,10.16 R-BATT1.2
  Bottom 0.61: C-BATT.1 73.53,7.6 R-BATT2.2 R-BATT1.2
P23
  Bottom 0.305: U1.23 56.63,41.16 57.15,40.64 OK-ICU.4
  Bottom 0.61: R-ICU5.2 58.27,38.25 OK-ICU.4
P33
  Bottom 0.305: U1.33 45.78,48.32 44.45,46.99 44.45,22.86 34.29,12.7 OK-IAC4.2
P34
  Bottom 0.305: U1.34 43.74,48.82 43.18,48.26 43.18,27.94 34.29,19.05 OK-IAC3.2
P35
  Bottom 0.305: U1.35 42.97,49.32 41.91,48.26 41.91,34.29 33.02,25.4 OK-IAC2.2
P36
  Bottom 0.305: U1.36 42.2,49.82 40.64,48.26 40.64,36.83 35.56,31.75 OK-IAC1.2
P37
  Bottom 0.305: U1.37 40.16,50.32 39.37,49.53 39.37,39.37 35.56,35.56 34.42,35.56 C-TACHO.2 34.29,36.83 33.02,36.83 31.75,38.1 OK-TACHO.2
P38
  Bottom 0.305: U1.38 39.39,50.82 38.1,49.53 38.1,44.45 35.56,41.91 34.42,41.91 C-PUMP.2 34.29,43.18 33.02,43.18 31.75,44.45 OK-PUMP.2
P39
  Bottom 0.305: U1.39 38.62,51.32 35.56,48.26 34.42,48.26 C-IGN.2 34.29,49.53 33.02,49.53 31.75,50.8 OK-IGN.2
P40
  Bottom 0.305: U1.40 38.35,51.82 35.56,54.61 34.42,54.61 C-INJ.2 34.29,55.88 33.02,55.88 31.75,57.15 OK-INJ.2
P41
  Bottom 0.305: U1.41 46.74,52.32 45.72,53.34 45.72,55.88 44.45,57.15 38.1,57.15 35.71,59.54 L-RUN.C
P42
  Bottom 0.305: U1.42 47.51,52.82 46.99,53.34 46.99,57.15 45.72,57.15 44.8,58.06 IC1.5
P43
  Bottom 0.305: U1.43 48.28,53.32 48.26,53.34 48.26,58.42 47.41,59.27 IC1.1
PUMP
  Bottom 0.61: OK-PUMP.4 22.71,41.76 R-PUMP2.2 15.09,41.91 13.97,41.91 10.16,38.1 CON1.5
TACHO
  Bottom 0.61: OK-TACHO.4 22.71,35.41 R-TACHO2.2 15.09,35.56 CON1.6
TPS
  Bottom 0.61: R-TPS1.1 77.47,48.26 78.74,46.99 78.74,43.18 80.01,41.91 81.18,41.91 ANALOG.3
V12  (via drill 0.8 pad 1.68)
  Top 0.61: v19.05,57.15 v19.05,50.8 | v17.78,44.45 v17.78,50.8 | v19.05,44.45 v19.05,38.1
  Bottom 0.61: 47.39,5.22 47.26,5.35 | 47.26,5.35 IC2.1 | v19.05,57.15 18.9,57.3 R-INJ2.1 15.09,57.15 12.7,57.15 8.89,53.34 CON1.1 | v19.05,50.8 v17.78,50.8 15.39,50.8 R-IGN2.1 | R-PUMP2.1 17.63,44.6 v17.78,44.45 v19.05,44.45 | 38.1,3.81 8.89,3.81 5.08,7.62 5.08,35.56 6.35,36.83 12.7,36.83 13.97,38.1 15.09,38.1 R-TACHO2.1 15.39,38.1 v19.05,38.1 | 38.1,3.81 46.99,3.81 | 46.99,3.81 46.99,5.08 47.26,5.35 | IC3.1 40.9,14.23 39.37,12.7 39.37,5.08 38.1,3.81 | C-V12.+ 60.96,3.81 59.69,2.54 48.26,2.54 46.99,3.81
VCC  (via drill 0.6)
  Top 0.406: v49.91,68.71 v35.69,68.71 | v52.7,77.09 v35.18,77.09
  Bottom 0.305: IC2.2 47.25,11.17 48.26,10.16 48.26,6.35 49.53,5.08 57.15,5.08 58.42,6.35 58.42,7.62 62.23,7.62 63.5,6.35 69.85,6.35 71.12,5.08
  Bottom 0.406: IC1.20 42.2,68.11 42.8,68.71 v49.91,68.71 | USB.1 40.56,71.04 40.01,70.48 37.21,70.48 35.69,68.96 v35.69,68.71 35.05,69.34 35.05,77.09 v35.18,77.09 | ANALOG.1 78,51.79 76.33,53.47 76.33,69.6 74.17,71.75 63.75,71.75 63.25,72.26 63.25,74.55 60.71,77.09 v52.7,77.09
  Bottom 0.61: 45.88,11.29 IC2.2 45.72,10.89 45.72,8.89 44.45,8.89 43.18,7.62 C-VCC.+ | 71.12,5.08 71.12,3.81 72.39,2.54 81.28,2.54 85.09,6.35 85.09,49.53 82.55,52.07 81.56,52.07 ANALOG.1
VCC2  (via drill 0.8 pad 1.68)
  Top 0.61: v19.05,31.75 v19.05,25.4 | v17.78,25.4 v17.78,19.05 | v19.05,19.05 v19.05,12.7
  Bottom 0.61: v19.05,31.75 18.9,31.9 R-IACB1.1 14.12,33.02 CON1.7 | v19.05,25.4 v17.78,25.4 17.63,25.55 R-IACB2.1 | v19.05,19.05 v17.78,19.05 17.63,19.2 R-IACB3.1 | R-IACB4.1 16.66,12.7 v19.05,12.7 20.32,11.43 24.13,11.43 25.4,10.16 25.4,8.89 26.67,7.62 34.29,7.62 38.1,11.43 38.1,13.97 43.18,19.05 45.74,19.05 IC3.2
VDD  (via drill 0.8 pad 1.68)
  Top 0.305: v64.77,35.56 v54.61,35.56 | v64.77,46.99 v64.77,43.18 | v52.07,43.18 v62.23,43.18
  Bottom 0.305: PULSER.1 62.23,22.86 64.77,25.4 v64.77,35.56 | U1.1 59.75,55.82 | 59.75,55.82 59.69,55.88 59.69,57.71 U1.64 | U1.19 58.63,44.24 59.69,43.18 v62.23,43.18 v64.77,43.18 | v64.77,46.99 60.96,46.99 59.69,48.26 59.69,49.53 59.98,49.82 U1.13 62.52,49.82 64.77,52.07 64.02,52.82 U1.7 60.21,52.82 59.69,53.34 59.69,55.76 59.75,55.82 | U1.48 50.74,55.82 50.8,55.88 50.8,58.42 52.07,59.69 | 52.07,59.69 54.61,59.69 54.61,63.5 | IC1.4 45.45,60.7 45.72,60.96 45.72,62.23 44.45,63.5 41.91,63.5 40.26,65.16 IC1.17 | 52.07,59.69 50.8,60.96 v49.53,60.96 48.26,62.23 | U1.32 50.18,46.37 46.99,43.18 R-ICU3.2 | OK-ICU.6 v52.07,43.18
  Bottom 0.406: OK-ICU.6 49.53,39.37 R-ICU4.2 | 45.72,62.23 48.26,62.23 | 40.26,65.16 40.26,64.89 39.75,64.39 38.61,64.39 36.83,66.17 28.07,66.17 27.81,65.91 27.81,64.8 R-IPWR.2 | U1.64 59.63,58.36 61.85,60.58 61.85,73.79 60.2,75.44 56.39,75.44 54.74,73.79 54.74,72.4 C-VDD.+
  Bottom 0.61: R-ICU3.2 R-ICU4.2 | R-ICU5.1 54.76,35.41 v54.61,35.56 52.07,38.1 OK-ICU.6 | R-RUN.2 R-IPWR.2 | BOOT.1 54.61,63.5 54.61,66.97 D-V33.C 54.95,72.19 C-VDD.+
VDDO
  Bottom 0.305: C-IGN.1 34.16,50.93 33.02,52.07 29.06,52.07 R-IGN1.2 | C-INJ.1 34.16,57.28 33.02,58.42 29.06,58.42 R-INJ1.2 | C-PUMP.1 34.16,44.58 33.02,45.72 29.06,45.72 R-PUMP1.2 | C-TACHO.1 34.16,38.23 33.02,39.37 29.06,39.37 R-TACHO1.2
  Bottom 0.406: R-INJ1.2 26.82,57.3 25.4,55.88 25.4,50.8 | 25.4,50.8 25.4,44.45 | 25.4,44.45 25.4,38.1 | 25.4,38.1 25.4,31.75 | 25.4,31.75 25.4,25.4 | 25.4,25.4 25.4,19.05 | 25.4,19.05 25.4,13.97 26.67,12.7 27.79,12.7 R-IACA4.2 | R-IACA3.2 25.55,19.2 25.4,19.05 | R-IACA2.2 25.55,25.55 25.4,25.4 | R-IACA1.2 25.55,31.9 25.4,31.75 | R-TACHO1.2 25.55,38.25 25.4,38.1 | R-PUMP1.2 25.55,44.6 25.4,44.45 | R-IGN1.2 25.55,50.95 25.4,50.8
VSS  (via drill 0.6)
  Top 0.305: v33.4,75.31 v50.55,75.31 | v59.44,64.77 v52.7,64.77
  Top 0.406: v59.31,70.23 v64.9,70.23
  Bottom 0.305: 59.69,44.45 59.13,45.01 U1.18 59.13,47.55 58.42,48.26 53.34,48.26 | 53.34,48.26 54.13,47.47 U1.28 54.13,41.12 54.61,40.64 OK-ICU.5 54.61,38.1 55.88,36.83 60.96,36.83 62.23,35.56 C-ICU.2 59.71,33.15 R-ICU2.1 | U1.31 52.63,47.55 53.34,48.26 | U1.12 58.42,50.32 | 58.42,50.32 54.13,50.32 53.34,49.53 | 53.34,49.53 53.34,48.26 | U1.47 52.63,55.32 53.34,54.61 53.34,49.53 | 58.42,50.32 59.13,51.03 U1.63 59.13,61.67 BOOT.3 59.69,62.36 59.31,62.74 59.44,62.87 v59.44,64.77 | TR-ICU.E 48.58,26.99 49.53,27.94 50.8,27.94 52.07,29.21 53.34,29.21 53.34,33.02 54.61,34.29 58.57,34.29 R-ICU2.1 | 59.54,33.02 R-ICU2.1 | IC1.7 43.51,58.74 43.18,58.42 38.1,58.42 38.1,63.5 36.83,64.77 L-IPWR.C 34.54,64.77 34.29,64.52 34.29,60.33 33.66,59.69 26.42,59.69 25.91,60.2 25.91,66.55 27.56,68.2 33.4,68.2 v33.4,75.31 | v50.55,75.31 50.55,70.36 50.67,70.23 | v52.7,64.77 51.56,64.77 50.67,65.66
  Bottom 0.406: R-BATT2.1 74.93,7.62 74.93,15.24 | 74.93,15.24 74.93,22.86 | 74.93,22.86 74.93,30.48 | 74.93,30.48 74.93,38.1 | 74.93,38.1 74.93,43.18 C-TPS.2 | R-MAP2.1 74.93,38.1 | R-MAT2.1 74.93,30.48 | R-CLT2.1 74.93,22.86 | R-O22.1 74.93,15.24 | R-TPS2.1 74.93,45.72 74.93,50.8 | 74.93,50.8 77.27,50.8 ANALOG.2 | 74.93,50.8 74.93,55.88 73.66,57.15 71.25,57.15 C-X8B.1 | IC1.18 40.91,66.03 41.27,65.66 42.93,65.66 | 42.93,65.66 45.47,65.66 | 45.47,65.66 45.97,65.66 | IC1.25 45.45,65.67 45.47,65.66 | IC1.21 42.85,65.73 42.93,65.66 | USB.5 43.76,70.41 43.94,70.23 50.67,70.23 51.69,69.22 51.69,66.29 51.05,65.66 50.67,65.66 45.97,65.66 | IC1.26 46.1,65.79 45.97,65.66 | C-X8A.1 73.15,59.56 73.79,60.2 C-X32B.1 | BOOT.3 59.69,62.48 59.18,62.99 59.18,67.82 59.44,68.07 59.44,70.1 v59.31,70.23 | v64.9,70.23 65.15,70.23 65.53,70.61 72.9,70.61 73.91,69.6 73.91,67.43 C-X32A.1
  Bottom 0.61: TR-ICU.E 48.58,23.89 PULSER.3 49.53,22.86 48.26,21.59 48.26,13.97 48.9,13.34 | C-VDD.- 59.35,72.19 D-V33.A 59.35,62.57 BOOT.3 | C-X32A.1 C-X32B.1 | C-X8B.1 C-X8A.1 | C-BATT.2 76.33,7.6 R-BATT2.1 | C-O2.2 76.33,15.22 R-O22.1 | R-CLT2.1 76.35,20.34 C-CLT.2 | C-MAT.2 76.33,30.46 R-MAT2.1 | C-MAP.2 76.33,38.08 R-MAP2.1 | C-TPS.2 76.33,45.7 R-TPS2.1 | IC2.3 57.15,8.89 58.42,10.16 D-V12.A | 58.42,13.97 D-V12.A | D-V12.A 49.19,13.04 48.9,13.34 | 48.9,13.34 48.26,12.7 41.91,12.7 C-VCC.-